# Altium schematic sheet DC Power.SchDoc
size A4; SheetNumber: 4; SheetTotal: 5
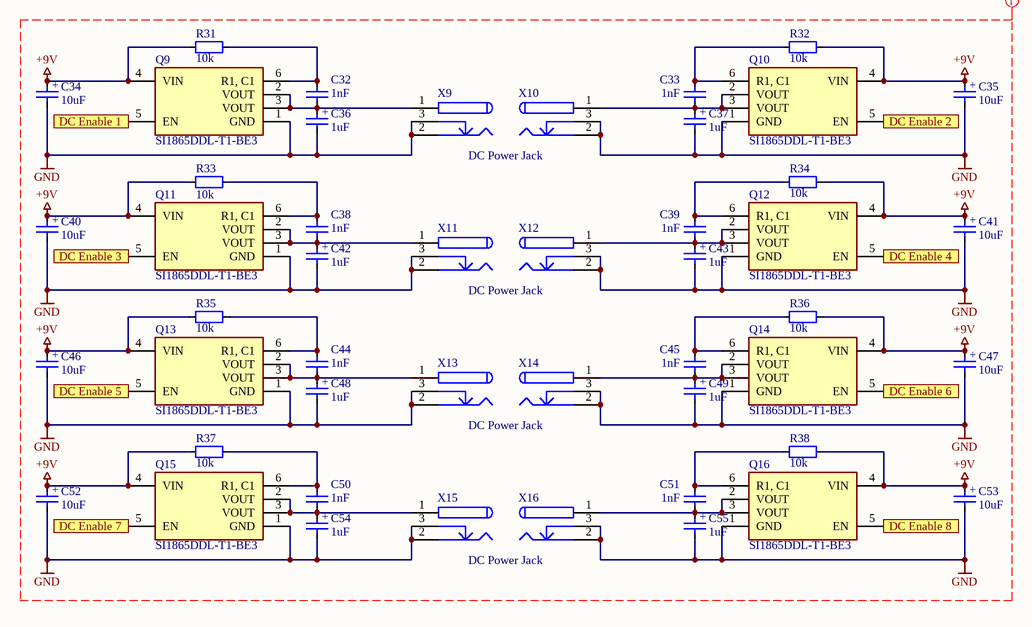
[diagram p0: DC Power.SchDoc]

## Parts
C32  value 1nF  [CAP CER 0805 H]  (hidden comment: Capacitor)
C33  value 1nF  [CAP CER 0805 H]  (hidden comment: Capacitor)
C34  value 10uF  [CAP TAN A R]  (hidden comment: Capacitor P)
C35  value 10uF  [CAP TAN A R]  (hidden comment: Capacitor P)
C36  value 1uF  [CAP TAN A R]  (hidden comment: Capacitor P)
C37  value 1uF  [CAP TAN A R]  (hidden comment: Capacitor P)
C38  value 1nF  [CAP CER 0805 H]  (hidden comment: Capacitor)
C39  value 1nF  [CAP CER 0805 H]  (hidden comment: Capacitor)
C40  value 10uF  [CAP TAN A R]  (hidden comment: Capacitor P)
C41  value 10uF  [CAP TAN A R]  (hidden comment: Capacitor P)
C42  value 1uF  [CAP TAN A R]  (hidden comment: Capacitor P)
C43  value 1uF  [CAP TAN A R]  (hidden comment: Capacitor P)
C44  value 1nF  [CAP CER 0805 H]  (hidden comment: Capacitor)
C45  value 1nF  [CAP CER 0805 H]  (hidden comment: Capacitor)
C46  value 10uF  [CAP TAN A R]  (hidden comment: Capacitor P)
C47  value 10uF  [CAP TAN A R]  (hidden comment: Capacitor P)
C48  value 1uF  [CAP TAN A R]  (hidden comment: Capacitor P)
C49  value 1uF  [CAP TAN A R]  (hidden comment: Capacitor P)
C50  value 1nF  [CAP CER 0805 H]  (hidden comment: Capacitor)
C51  value 1nF  [CAP CER 0805 H]  (hidden comment: Capacitor)
C52  value 10uF  [CAP TAN A R]  (hidden comment: Capacitor P)
C53  value 10uF  [CAP TAN A R]  (hidden comment: Capacitor P)
C54  value 1uF  [CAP TAN A R]  (hidden comment: Capacitor P)
C55  value 1uF  [CAP TAN A R]  (hidden comment: Capacitor P)
Q9  SI1865DDL-T1-BE3  [SOT-363]
Q10  SI1865DDL-T1-BE3  [SOT-363]
Q11  SI1865DDL-T1-BE3  [SOT-363]
Q12  SI1865DDL-T1-BE3  [SOT-363]
Q13  SI1865DDL-T1-BE3  [SOT-363]
Q14  SI1865DDL-T1-BE3  [SOT-363]
Q15  SI1865DDL-T1-BE3  [SOT-363]
Q16  SI1865DDL-T1-BE3  [SOT-363]
R31  value 10k  [RESMELF3514N]  (hidden comment: Resistor)
R32  value 10k  [RESMELF3514N]  (hidden comment: Resistor)
R33  value 10k  [RESMELF3514N]  (hidden comment: Resistor)
R34  value 10k  [RESMELF3514N]  (hidden comment: Resistor)
R35  value 10k  [RESMELF3514N]  (hidden comment: Resistor)
R36  value 10k  [RESMELF3514N]  (hidden comment: Resistor)
R37  value 10k  [RESMELF3514N]  (hidden comment: Resistor)
R38  value 10k  [RESMELF3514N]  (hidden comment: Resistor)
X9  DC Power Jack  [282841-3]
X10  DC Power Jack  [282841-3]  (value not drawn)
X11  DC Power Jack  [282841-3]
X12  DC Power Jack  [282841-3]  (value not drawn)
X13  DC Power Jack  [282841-3]
X14  DC Power Jack  [282841-3]  (value not drawn)
X15  DC Power Jack  [282841-3]
X16  DC Power Jack  [282841-3]  (value not drawn)

## Ports
DC Enable 1 (in), DC Enable 2 (in), DC Enable 3 (in), DC Enable 4 (in), DC Enable 5 (in), DC Enable 6 (in), DC Enable 7 (in), DC Enable 8 (in)

## Nets
+9V: C34.A(Anode) C35.A(Anode) C40.A(Anode) C41.A(Anode) C46.A(Anode) C47.A(Anode) C52.A(Anode) C53.A(Anode) Q9.4(VIN) Q10.4(VIN) Q11.4(VIN) Q12.4(VIN) Q13.4(VIN) Q14.4(VIN) Q15.4(VIN) Q16.4(VIN) R31.2 R32.2 R33.2 R34.1 R35.2 R36.1 R37.2 R38.1
GND: C34.C(Cathode) C35.C(Cathode) C36.C(Cathode) C37.C(Cathode) C40.C(Cathode) C41.C(Cathode) C42.C(Cathode) C43.C(Cathode) C46.C(Cathode) C47.C(Cathode) C48.C(Cathode) C49.C(Cathode) C52.C(Cathode) C53.C(Cathode) C54.C(Cathode) C55.C(Cathode) Q9.1(GND) Q10.1(GND) Q11.1(GND) Q12.1(GND) Q13.1(GND) Q14.1(GND) Q15.1(GND) Q16.1(GND) X9.2 X9.3 X10.2 X10.3 X11.2 X11.3 X12.2 X12.3 X13.2 X13.3 X14.2 X14.3 X15.2 X15.3 X16.2 X16.3
DC Enable 1: Q9.5(EN) ; port DC Enable 1
DC Enable 2: Q10.5(EN) ; port DC Enable 2
DC Enable 3: Q11.5(EN) ; port DC Enable 3
DC Enable 4: Q12.5(EN) ; port DC Enable 4
DC Enable 5: Q13.5(EN) ; port DC Enable 5
DC Enable 6: Q14.5(EN) ; port DC Enable 6
DC Enable 7: Q15.5(EN) ; port DC Enable 7
DC Enable 8: Q16.5(EN) ; port DC Enable 8
NetC32_1: C32.1 C36.A(Anode) Q9.2(VOUT) Q9.3(VOUT) X9.1
NetC32_2: C32.2 Q9.6(R1,_C1) R31.1
NetC33_1: C33.1 C37.A(Anode) Q10.2(VOUT) Q10.3(VOUT) X10.1
NetC33_2: C33.2 Q10.6(R1,_C1) R32.1
NetC38_1: C38.1 C42.A(Anode) Q11.2(VOUT) Q11.3(VOUT) X11.1
NetC38_2: C38.2 Q11.6(R1,_C1) R33.1
NetC39_1: C39.1 C43.A(Anode) Q12.2(VOUT) Q12.3(VOUT) X12.1
NetC39_2: C39.2 Q12.6(R1,_C1) R34.2
NetC44_1: C44.1 C48.A(Anode) Q13.2(VOUT) Q13.3(VOUT) X13.1
NetC44_2: C44.2 Q13.6(R1,_C1) R35.1
NetC45_1: C45.1 C49.A(Anode) Q14.2(VOUT) Q14.3(VOUT) X14.1
NetC45_2: C45.2 Q14.6(R1,_C1) R36.2
NetC50_1: C50.1 C54.A(Anode) Q15.2(VOUT) Q15.3(VOUT) X15.1
NetC50_2: C50.2 Q15.6(R1,_C1) R37.1
NetC51_1: C51.1 C55.A(Anode) Q16.2(VOUT) Q16.3(VOUT) X16.1
NetC51_2: C51.2 Q16.6(R1,_C1) R38.2

## Notes on the sheet
- Bahnhöheweg 70
- ICT Berufsbildungscenter AG
- Bereich Elektronik
- Datum:
- Version:
- Blattgrösse:
- Blattnummer:
- A4
- /
- 3018 Bern
- Dateiname:
- (in symbol Capacitor P) +

## Library data of the parts
C32 C33 C38 C39 C44 C45 C50 C51 = Capacitor: Non polarized capacitor; LatestRevisionDate: 01.04.2019; Publisher: ICT Berufsbildungscenter AG
C34-C37 C40-C43 C46-C49 C52-C55 = Capacitor P: Polarized Capacitor; LatestRevisionDate: 02.04.2019; Publisher: ICT Berufsbildungscenter AG
X9-X16 = DC Power Jack: DC Power Jack 9V
R31-R38 = Resistor: LatestRevisionDate: 02.04.2019; Publisher: ICT Berufsbildungscenter AG